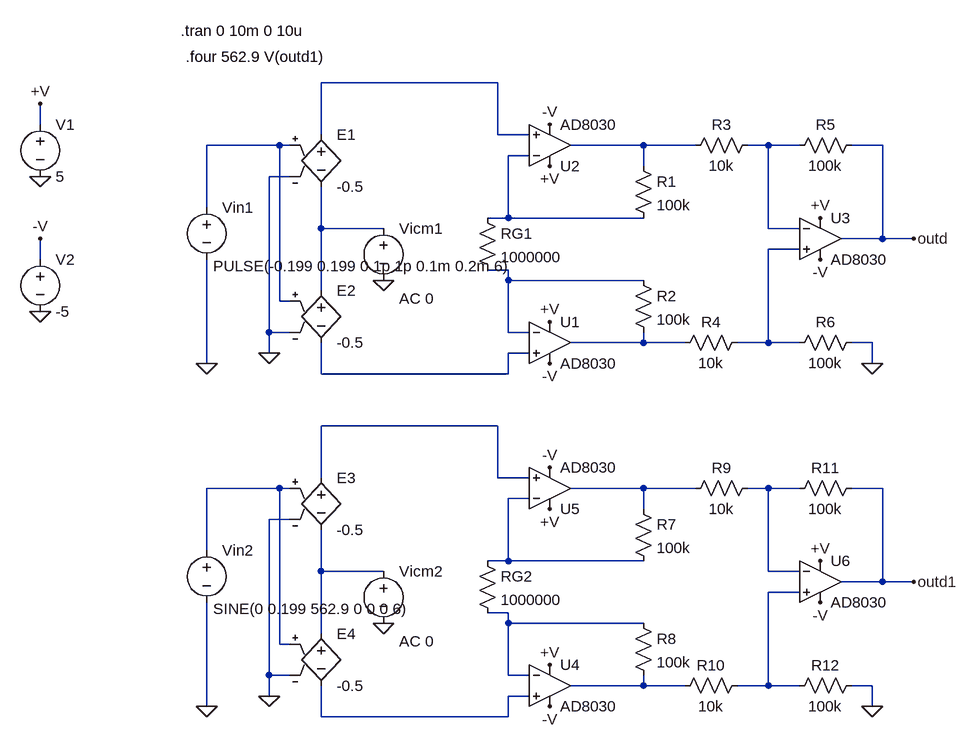
[diagram p0: schematic Stage1_Transient.asc]
Stage1_Transient.asc, the LTspice schematic file:
Version 4
SHEET 1 880 872
WIRE 80 -160 -192 -160
WIRE -624 -96 -624 -128
WIRE -192 -80 -192 -160
WIRE 80 -80 80 -160
WIRE 128 -80 80 -80
WIRE -256 -64 -368 -64
WIRE -240 -64 -256 -64
WIRE 304 -64 192 -64
WIRE 384 -64 304 -64
WIRE 496 -64 464 -64
WIRE 544 -64 496 -64
WIRE 672 -64 624 -64
WIRE 128 -48 96 -48
WIRE 304 -32 304 -64
WIRE -240 -16 -272 -16
WIRE -368 32 -368 -64
WIRE 96 48 96 -48
WIRE 96 48 64 48
WIRE 304 48 96 48
WIRE -192 64 -192 0
WIRE -96 64 -192 64
WIRE 496 64 496 -64
WIRE 544 64 496 64
WIRE 672 80 672 -64
WIRE 672 80 608 80
WIRE 720 80 672 80
WIRE 544 96 496 96
WIRE -624 112 -624 80
WIRE 96 128 64 128
WIRE 96 144 96 128
WIRE 304 144 96 144
WIRE -192 160 -192 64
WIRE -256 176 -256 -64
WIRE -240 176 -256 176
WIRE -272 224 -272 -16
WIRE -240 224 -272 224
WIRE 96 224 96 144
WIRE 128 224 96 224
WIRE 304 240 304 224
WIRE 304 240 192 240
WIRE 368 240 304 240
WIRE 496 240 496 96
WIRE 496 240 448 240
WIRE 544 240 496 240
WIRE 656 240 624 240
WIRE -272 256 -272 224
WIRE 128 256 96 256
WIRE -368 272 -368 112
WIRE 656 272 656 240
WIRE -192 288 -192 240
WIRE 96 288 96 256
WIRE 96 288 -192 288
WIRE 80 368 -192 368
WIRE -192 448 -192 368
WIRE 80 448 80 368
WIRE 128 448 80 448
WIRE -256 464 -368 464
WIRE -240 464 -256 464
WIRE 304 464 192 464
WIRE 384 464 304 464
WIRE 496 464 464 464
WIRE 544 464 496 464
WIRE 672 464 624 464
WIRE 128 480 96 480
WIRE 304 496 304 464
WIRE -240 512 -272 512
WIRE -368 560 -368 464
WIRE 96 576 96 480
WIRE 96 576 64 576
WIRE 304 576 96 576
WIRE -192 592 -192 528
WIRE -96 592 -192 592
WIRE 496 592 496 464
WIRE 544 592 496 592
WIRE 672 608 672 464
WIRE 672 608 608 608
WIRE 720 608 672 608
WIRE 544 624 496 624
WIRE 96 656 64 656
WIRE 96 672 96 656
WIRE 304 672 96 672
WIRE -192 688 -192 592
WIRE -256 704 -256 464
WIRE -240 704 -256 704
WIRE -272 752 -272 512
WIRE -240 752 -272 752
WIRE 96 752 96 672
WIRE 128 752 96 752
WIRE 304 768 304 752
WIRE 304 768 192 768
WIRE 368 768 304 768
WIRE 496 768 496 624
WIRE 496 768 448 768
WIRE 544 768 496 768
WIRE 656 768 624 768
WIRE -272 784 -272 752
WIRE 128 784 96 784
WIRE -368 800 -368 640
WIRE 656 800 656 768
WIRE -192 816 -192 768
WIRE 96 816 96 784
WIRE 96 816 -192 816
FLAG 160 272 -V
FLAG 720 80 outd
FLAG 656 272 0
FLAG 576 48 +V
FLAG -272 256 0
FLAG -368 272 0
FLAG 576 112 -V
FLAG -96 144 0
FLAG 160 -32 +V
FLAG 160 208 +V
FLAG 160 -96 -V
FLAG -624 -16 0
FLAG -624 192 0
FLAG -624 -128 +V
FLAG -624 80 -V
FLAG 160 800 -V
FLAG 720 608 outd1
FLAG 656 800 0
FLAG 576 576 +V
FLAG -272 784 0
FLAG -368 800 0
FLAG 576 640 -V
FLAG -96 672 0
FLAG 160 496 +V
FLAG 160 736 +V
FLAG 160 432 -V
SYMBOL res 48 32 R0
SYMATTR InstName RG1
SYMATTR Value 1000000
SYMBOL res 288 -48 R0
SYMATTR InstName R1
SYMATTR Value 100k
SYMBOL res 288 128 R0
SYMATTR InstName R2
SYMATTR Value 100k
SYMBOL res 480 -80 R90
WINDOW 0 0 56 VBottom 2
WINDOW 3 32 56 VTop 2
SYMATTR InstName R3
SYMATTR Value 10k
SYMBOL res 464 224 R90
WINDOW 0 0 56 VBottom 2
WINDOW 3 32 56 VTop 2
SYMATTR InstName R4
SYMATTR Value 10k
SYMBOL res 640 -80 R90
WINDOW 0 0 56 VBottom 2
WINDOW 3 32 56 VTop 2
SYMATTR InstName R5
SYMATTR Value 100k
SYMBOL res 640 224 R90
WINDOW 0 0 56 VBottom 2
WINDOW 3 32 56 VTop 2
SYMATTR InstName R6
SYMATTR Value 100k
SYMBOL voltage -368 16 R0
WINDOW 123 24 124 Left 2
WINDOW 39 0 0 Left 0
WINDOW 3 10 106 Left 2
SYMATTR Value PULSE(-0.199 0.199 0 1p 1p 0.1m 0.2m 6)
SYMATTR InstName Vin1
SYMBOL e -192 -96 R0
SYMATTR InstName E1
SYMATTR Value -0.5
SYMBOL e -192 144 R0
SYMATTR InstName E2
SYMATTR Value -0.5
SYMBOL voltage -96 48 R0
WINDOW 123 24 124 Left 2
WINDOW 39 0 0 Left 0
WINDOW 3 24 152 Left 2
SYMATTR Value2 AC 0
SYMATTR Value ""
SYMATTR InstName Vicm1
SYMBOL OpAmps\\AD8030 160 176 R0
SYMATTR InstName U1
SYMBOL OpAmps\\AD8030 160 0 M180
SYMATTR InstName U2
SYMBOL OpAmps\\AD8030 576 16 R0
SYMATTR InstName U3
SYMBOL voltage -624 -112 R0
WINDOW 123 0 0 Left 0
WINDOW 39 0 0 Left 0
SYMATTR InstName V1
SYMATTR Value 5
SYMBOL voltage -624 96 R0
WINDOW 123 0 0 Left 0
WINDOW 39 0 0 Left 0
SYMATTR InstName V2
SYMATTR Value -5
SYMBOL res 48 560 R0
SYMATTR InstName RG2
SYMATTR Value 1000000
SYMBOL res 288 480 R0
SYMATTR InstName R7
SYMATTR Value 100k
SYMBOL res 288 656 R0
SYMATTR InstName R8
SYMATTR Value 100k
SYMBOL res 480 448 R90
WINDOW 0 0 56 VBottom 2
WINDOW 3 32 56 VTop 2
SYMATTR InstName R9
SYMATTR Value 10k
SYMBOL res 464 752 R90
WINDOW 0 0 56 VBottom 2
WINDOW 3 32 56 VTop 2
SYMATTR InstName R10
SYMATTR Value 10k
SYMBOL res 640 448 R90
WINDOW 0 0 56 VBottom 2
WINDOW 3 32 56 VTop 2
SYMATTR InstName R11
SYMATTR Value 100k
SYMBOL res 640 752 R90
WINDOW 0 0 56 VBottom 2
WINDOW 3 32 56 VTop 2
SYMATTR InstName R12
SYMATTR Value 100k
SYMBOL voltage -368 544 R0
WINDOW 123 24 124 Left 2
WINDOW 39 0 0 Left 0
WINDOW 3 10 106 Left 2
SYMATTR Value SINE(0 0.199 562.9 0 0 0 6)
SYMATTR InstName Vin2
SYMBOL e -192 432 R0
SYMATTR InstName E3
SYMATTR Value -0.5
SYMBOL e -192 672 R0
SYMATTR InstName E4
SYMATTR Value -0.5
SYMBOL voltage -96 576 R0
WINDOW 123 24 124 Left 2
WINDOW 39 0 0 Left 0
WINDOW 3 24 152 Left 2
SYMATTR Value2 AC 0
SYMATTR Value ""
SYMATTR InstName Vicm2
SYMBOL OpAmps\\AD8030 160 704 R0
SYMATTR InstName U4
SYMBOL OpAmps\\AD8030 160 528 M180
SYMATTR InstName U5
SYMBOL OpAmps\\AD8030 576 544 R0
SYMATTR InstName U6
TEXT -408 -240 Left 2 !.tran 0 10m 0 10u
TEXT -400 -200 Left 2 !.four 562.9 V(outd1)

The netlist it stands for:
* Stage1_Transient.asc
RG1 N005 N008 1000000
R1 N003 N005 100k
R2 N008 N009 100k
R3 N004 N003 10k
R4 N007 N009 10k
R5 outd N004 100k
R6 0 N007 100k
Vin1 N002 0 PULSE(-0.199 0.199 0 1p 1p 0.1m 0.2m 6)
E1 N001 N006 N002 0 -0.5
E2 N006 N010 N002 0 -0.5
Vicm1 N006 0 AC 0
XU1 N010 N008 +V -V N009 AD8040  ; AD8030, pins In+ In- V+ V- OUT
XU2 N001 N005 +V -V N003 AD8040  ; AD8030, pins In+ In- V+ V- OUT
XU3 N007 N004 +V -V outd AD8040  ; AD8030, pins In+ In- V+ V- OUT
V1 +V 0 5
V2 -V 0 -5
RG2 N015 N018 1000000
R7 N013 N015 100k
R8 N018 N019 100k
R9 N014 N013 10k
R10 N017 N019 10k
R11 outd1 N014 100k
R12 0 N017 100k
Vin2 N012 0 SINE(0 0.199 562.9 0 0 0 6)
E3 N011 N016 N012 0 -0.5
E4 N016 N020 N012 0 -0.5
Vicm2 N016 0 AC 0
XU4 N020 N018 +V -V N019 AD8040  ; AD8030, pins In+ In- V+ V- OUT
XU5 N011 N015 +V -V N013 AD8040  ; AD8030, pins In+ In- V+ V- OUT
XU6 N017 N014 +V -V outd1 AD8040  ; AD8030, pins In+ In- V+ V- OUT
.tran 0 10m 0 10u
.four 562.9 V(outd1)
.lib ADI.lib
.backanno
.end